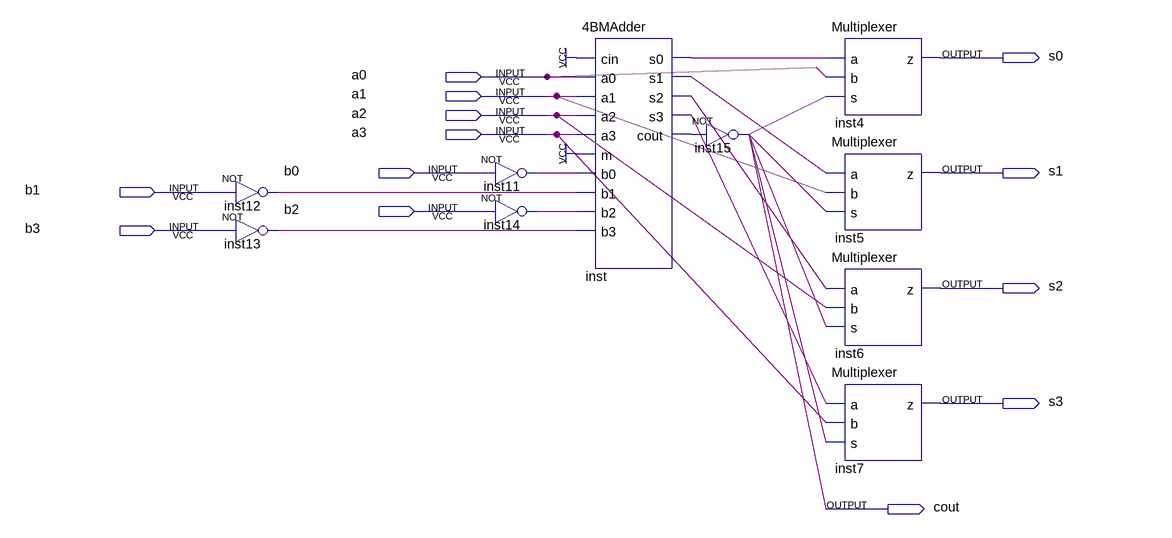
[diagram p0: schematic sheet]
// Quartus schematic 4BITSubMux.bdf as structural Verilog: 10 symbols, 13 pins
module \4BITSubMux  (
  input  a0,
  input  a1,
  input  a2,
  input  a3,
  input  b0,
  input  b1,
  input  b2,
  input  b3,
  output s0,
  output s1,
  output s2,
  output s3,
  output cout
);

  wire inst11_out, inst12_out, inst13_out, inst14_out, inst_cout, inst_s0, inst_s1, inst_s2, inst_s3;

  not inst12 (inst12_out, b1);
  not inst13 (inst13_out, b3);
  not inst11 (inst11_out, b0);
  not inst14 (inst14_out, b2);
  \4BMAdder  inst (
    .cin(1'b1), .a0(a0), .a1(a1), .a2(a2), .a3(a3), .m(1'b1), .b0(inst11_out), .b1(inst12_out),
    .b2(inst14_out), .b3(inst13_out), .s0(inst_s0), .s1(inst_s1), .s2(inst_s2), .s3(inst_s3), .cout(inst_cout));
  not inst15 (cout, inst_cout);
  Multiplexer inst4 (.a(inst_s0), .b(a0), .s(cout), .z(s0));
  Multiplexer inst5 (.a(inst_s1), .b(a1), .s(cout), .z(s1));
  Multiplexer inst6 (.a(inst_s2), .b(a2), .s(cout), .z(s2));
  Multiplexer inst7 (.a(inst_s3), .b(a3), .s(cout), .z(s3));
endmodule
